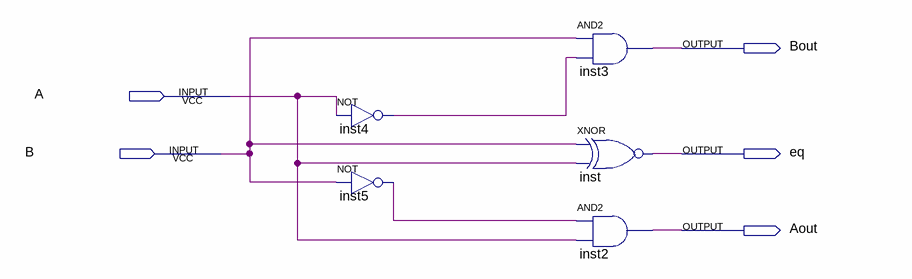
[diagram p0: schematic sheet]
// Quartus schematic Compare_1.bdf as structural Verilog: 5 symbols, 5 pins
module Compare_1 (
  input  A,
  input  B,
  output Bout,
  output eq,
  output Aout
);

  wire inst4_out, inst5_out;

  not inst4 (inst4_out, A);
  not inst5 (inst5_out, B);
  and inst3 (Bout, B, inst4_out);
  xnor inst (eq, B, A);
  and inst2 (Aout, inst5_out, A);
endmodule
